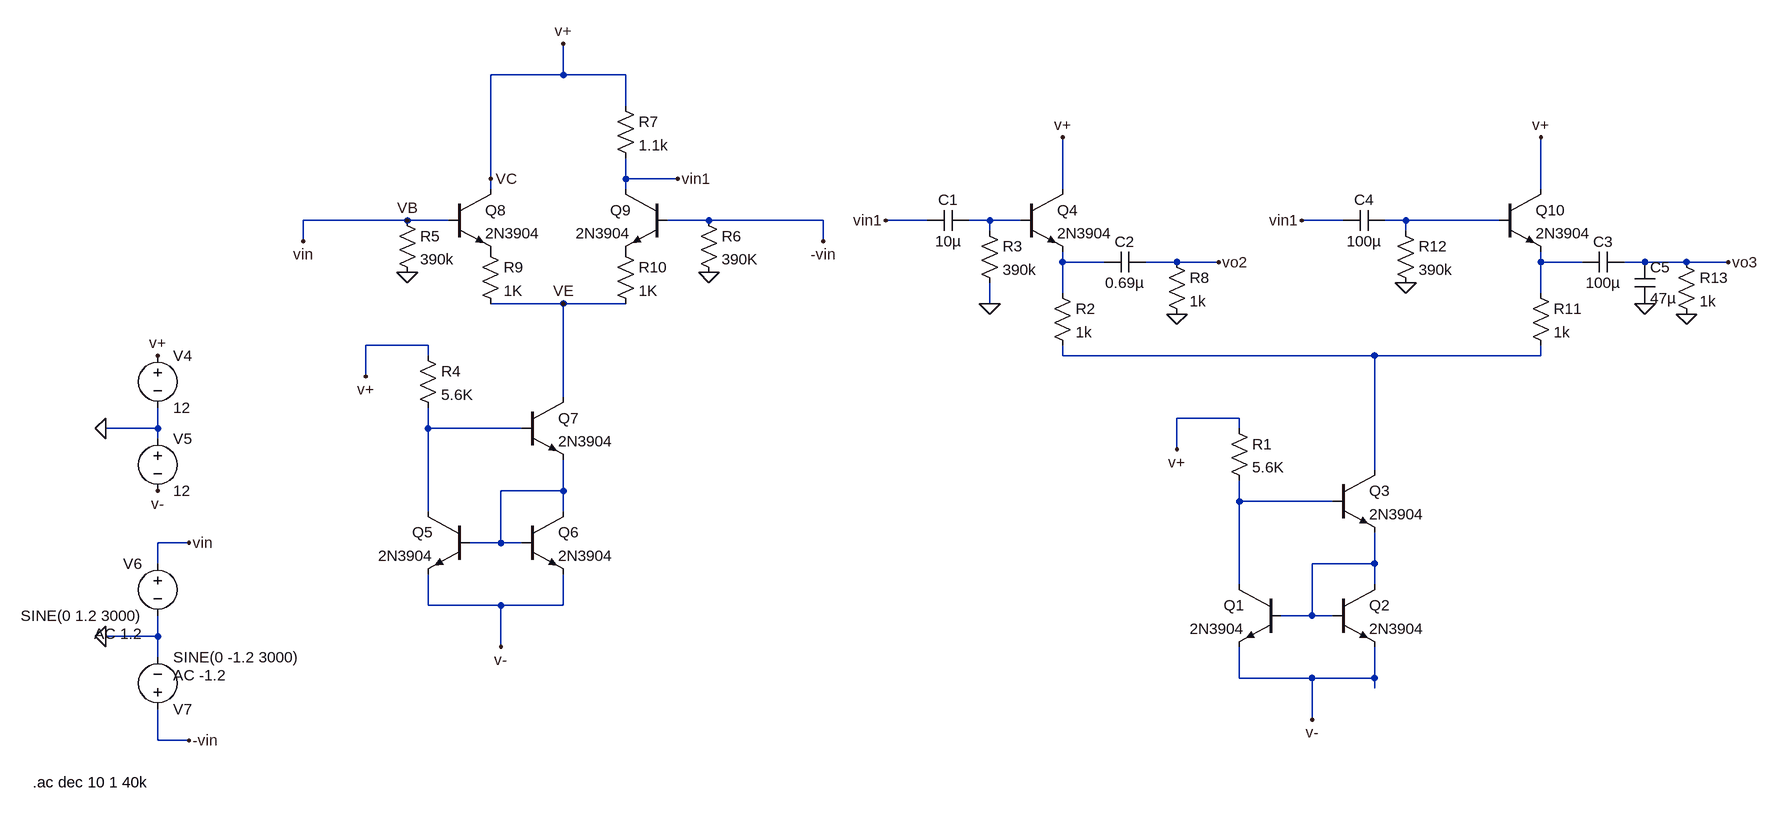
[diagram p0: schematic amp_filtrado.asc]
amp_filtrado.asc, the LTspice schematic file:
Version 4
SHEET 1 1180 784
WIRE -752 -320 -752 -368
WIRE -752 -320 -864 -320
WIRE -656 -320 -752 -320
WIRE -656 -272 -656 -320
WIRE -864 -160 -864 -320
WIRE -656 -160 -656 -192
WIRE -576 -160 -656 -160
WIRE -864 -144 -864 -160
WIRE -656 -144 -656 -160
WIRE 16 -144 16 -224
WIRE 752 -144 752 -224
WIRE -992 -96 -1152 -96
WIRE -928 -96 -992 -96
WIRE -528 -96 -592 -96
WIRE -352 -96 -528 -96
WIRE -192 -96 -256 -96
WIRE -96 -96 -128 -96
WIRE -48 -96 -96 -96
WIRE 448 -96 384 -96
WIRE 544 -96 512 -96
WIRE 688 -96 544 -96
WIRE -96 -80 -96 -96
WIRE 544 -80 544 -96
WIRE -1152 -64 -1152 -96
WIRE -352 -64 -352 -96
WIRE 16 -32 16 -48
WIRE 80 -32 16 -32
WIRE 192 -32 144 -32
WIRE 256 -32 192 -32
WIRE 752 -32 752 -48
WIRE 816 -32 752 -32
WIRE 912 -32 880 -32
WIRE 976 -32 912 -32
WIRE 1040 -32 976 -32
WIRE 16 16 16 -32
WIRE 752 16 752 -32
WIRE -752 32 -864 32
WIRE -656 32 -752 32
WIRE -96 32 -96 0
WIRE -960 96 -1056 96
WIRE -960 112 -960 96
WIRE 16 112 16 96
WIRE 496 112 16 112
WIRE 752 112 752 96
WIRE 752 112 496 112
WIRE -1056 144 -1056 96
WIRE -752 176 -752 32
WIRE 288 208 192 208
WIRE -1376 224 -1376 192
WIRE -1376 224 -1456 224
WIRE -960 224 -960 192
WIRE -816 224 -960 224
WIRE 288 224 288 208
WIRE -1376 240 -1376 224
WIRE 192 256 192 208
WIRE 496 288 496 112
WIRE -752 320 -752 272
WIRE -752 320 -848 320
WIRE 288 336 288 304
WIRE 432 336 288 336
WIRE -960 352 -960 224
WIRE -752 352 -752 320
WIRE -1328 400 -1376 400
WIRE -848 400 -848 320
WIRE -848 400 -896 400
WIRE -816 400 -848 400
WIRE -1376 432 -1376 400
WIRE 496 432 496 384
WIRE 496 432 400 432
WIRE 288 464 288 336
WIRE 496 464 496 432
WIRE -960 496 -960 448
WIRE -848 496 -960 496
WIRE -752 496 -752 448
WIRE -752 496 -848 496
WIRE 400 512 400 432
WIRE 400 512 352 512
WIRE 432 512 400 512
WIRE -1376 544 -1376 512
WIRE -1376 544 -1456 544
WIRE -848 560 -848 496
WIRE -1376 576 -1376 544
WIRE 288 608 288 560
WIRE 400 608 288 608
WIRE 496 608 496 560
WIRE 496 608 400 608
WIRE 496 624 496 608
WIRE 400 672 400 608
WIRE -1376 704 -1376 656
WIRE -1328 704 -1376 704
FLAG 192 256 v+
FLAG 16 -224 v+
FLAG -96 32 0
FLAG -256 -96 vin1
FLAG 256 -32 vo2
FLAG -992 -96 VB
FLAG -752 32 VE
FLAG -864 -160 VC
FLAG -1376 320 v-
FLAG -1056 144 v+
FLAG -1376 112 v+
FLAG -992 -16 0
FLAG -528 -16 0
FLAG -752 -368 v+
FLAG -1456 224 0
FLAG -1328 400 vin
FLAG -1152 -64 vin
FLAG -352 -64 -vin
FLAG -1328 704 -vin
FLAG -1456 544 0
FLAG -576 -160 vin1
FLAG 192 48 0
FLAG 752 -224 v+
FLAG 544 0 0
FLAG 384 -96 vin1
FLAG 1040 -32 vo3
FLAG 976 48 0
FLAG -848 560 v-
FLAG 400 672 v-
FLAG 912 32 0
SYMBOL npn 352 464 M0
SYMATTR InstName Q1
SYMATTR Value 2N3904
SYMBOL npn 432 464 R0
SYMATTR InstName Q2
SYMATTR Value 2N3904
SYMBOL npn 432 288 R0
SYMATTR InstName Q3
SYMATTR Value 2N3904
SYMBOL res 272 208 R0
SYMATTR InstName R1
SYMATTR Value 5.6K
SYMBOL npn -48 -144 R0
SYMATTR InstName Q4
SYMATTR Value 2N3904
SYMBOL res 0 0 R0
SYMATTR InstName R2
SYMATTR Value 1k
SYMBOL res -112 -96 R0
SYMATTR InstName R3
SYMATTR Value 390k
SYMBOL cap 144 -48 R90
WINDOW 0 0 32 VBottom 2
WINDOW 3 32 32 VTop 2
SYMATTR InstName C2
SYMATTR Value 0.69µ
SYMBOL npn -896 352 M0
SYMATTR InstName Q5
SYMATTR Value 2N3904
SYMBOL npn -816 352 R0
SYMATTR InstName Q6
SYMATTR Value 2N3904
SYMBOL npn -816 176 R0
SYMATTR InstName Q7
SYMATTR Value 2N3904
SYMBOL res -976 96 R0
SYMATTR InstName R4
SYMATTR Value 5.6K
SYMBOL npn -928 -144 R0
SYMATTR InstName Q8
SYMATTR Value 2N3904
SYMBOL npn -592 -144 M0
SYMATTR InstName Q9
SYMATTR Value 2N3904
SYMBOL res -1008 -112 R0
SYMATTR InstName R5
SYMATTR Value 390k
SYMBOL res -544 -112 R0
SYMATTR InstName R6
SYMATTR Value 390K
SYMBOL res -672 -288 R0
SYMATTR InstName R7
SYMATTR Value 1.1k
SYMBOL voltage -1376 96 R0
WINDOW 123 0 0 Left 2
WINDOW 39 0 0 Left 2
SYMATTR InstName V4
SYMATTR Value 12
SYMBOL voltage -1376 224 R0
WINDOW 123 0 0 Left 2
WINDOW 39 0 0 Left 2
SYMATTR InstName V5
SYMATTR Value 12
SYMBOL res -880 -64 R0
SYMATTR InstName R9
SYMATTR Value 1K
SYMBOL res -672 -64 R0
SYMATTR InstName R10
SYMATTR Value 1K
SYMBOL voltage -1376 416 M0
WINDOW 123 24 124 Left 2
WINDOW 39 0 0 Left 2
SYMATTR Value2 AC 1.2
SYMATTR InstName V6
SYMATTR Value SINE(0 1.2 3000)
SYMBOL voltage -1376 672 M180
WINDOW 123 24 68 Left 2
WINDOW 39 0 0 Left 2
SYMATTR Value2 AC -1.2
SYMATTR InstName V7
SYMATTR Value SINE(0 -1.2 3000)
SYMBOL res 176 -48 R0
SYMATTR InstName R8
SYMATTR Value 1k
SYMBOL cap -128 -112 R90
WINDOW 0 0 32 VBottom 2
WINDOW 3 32 32 VTop 2
SYMATTR InstName C1
SYMATTR Value 10µ
SYMBOL npn 688 -144 R0
SYMATTR InstName Q10
SYMATTR Value 2N3904
SYMBOL res 736 0 R0
SYMATTR InstName R11
SYMATTR Value 1k
SYMBOL res 528 -96 R0
SYMATTR InstName R12
SYMATTR Value 390k
SYMBOL cap 880 -48 R90
WINDOW 0 0 32 VBottom 2
WINDOW 3 32 32 VTop 2
SYMATTR InstName C3
SYMATTR Value 100µ
SYMBOL res 960 -48 R0
SYMATTR InstName R13
SYMATTR Value 1k
SYMBOL cap 512 -112 R90
WINDOW 0 0 32 VBottom 2
WINDOW 3 32 32 VTop 2
SYMATTR InstName C4
SYMATTR Value 100µ
SYMBOL cap 896 -32 R0
SYMATTR InstName C5
SYMATTR Value 47µ
TEXT -1568 768 Left 2 !.ac dec 10 1 40k

The netlist it stands for:
* amp_filtrado.asc
Q1 N008 N009 v- 0 2N3904
Q2 N009 N009 v- 0 2N3904
Q3 N005 N008 N009 0 2N3904
R1 VC N008 5.6K
Q4 VC N001 N003 0 2N3904
R2 N003 N005 1k
R3 N001 0 390k
C2 vo2 N003 0.69µ
Q5 N006 N007 v- 0 2N3904
Q6 N007 N007 v- 0 2N3904
Q7 VE N006 N007 0 2N3904
R4 VC N006 5.6K
Q8 VC vin P001 0 2N3904
Q9 vin1 -vin P002 0 2N3904
R5 vin 0 390k
R6 -vin 0 390K
R7 VC vin1 1.1k
V4 VC 0 12
V5 0 v- 12
R9 P001 VE 1K
R10 P002 VE 1K
V6 vin 0 SINE(0 1.2 3000) AC 1.2
V7 -vin 0 SINE(0 -1.2 3000) AC -1.2
R8 vo2 0 1k
C1 N001 vin1 10µ
Q10 VC N002 N004 0 2N3904
R11 N004 N005 1k
R12 N002 0 390k
C3 vo3 N004 100µ
R13 vo3 0 1k
C4 N002 vin1 100µ
C5 vo3 0 47µ
.model NPN NPN
.model PNP PNP
.lib standard.bjt
.ac dec 10 1 40k
.backanno
.end